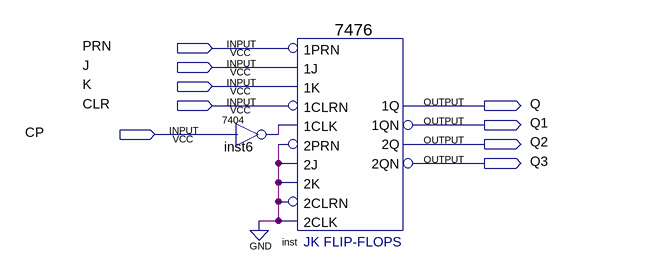
[diagram p0: schematic sheet]
// Quartus schematic Problem8A.bdf as structural Verilog: 2 symbols, 9 pins
module Problem8A (
  input  PRN,
  input  J,
  input  K,
  input  CLR,
  input  CP,
  output Q,
  output Q1,
  output Q2,
  output Q3
);

  wire inst6_1;

  \7404  inst6 (.\2 (CP), .\1 (inst6_1));
  \7476  inst (
    .\1J (J), .\1K (K), .\1PRN (PRN), .\2PRN (1'b0), .\2J (1'b0), .\1CLK (inst6_1), .\1CLRN (CLR),
    .\2K (1'b0), .\2CLRN (1'b0), .\2CLK (1'b0), .\2QN (Q3), .\1Q (Q), .\2Q (Q2), .\1QN (Q1));
endmodule
